# Altium schematic sheet CAN + LIN.SchDoc: MISKO 3.0
size A4; Date: 19.9.2021; Author: AMADEJ PAPEŽ; SheetNumber: 8; SheetTotal: 13; Version: V1.1; SheetTitle: CAN + LIN
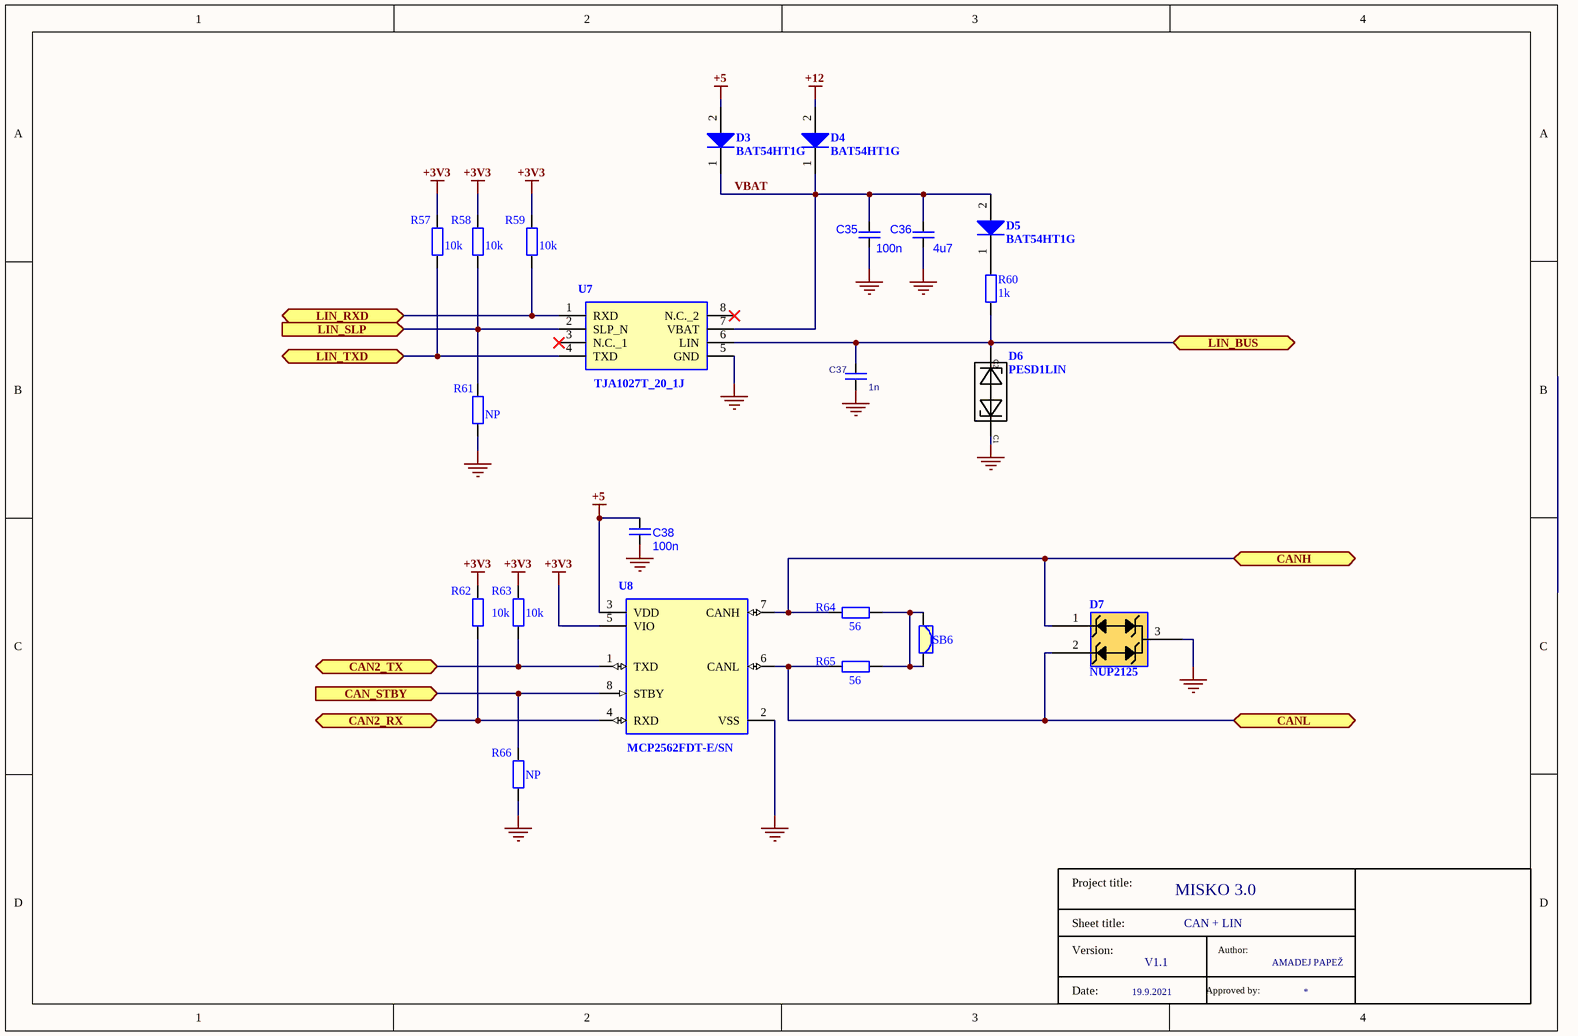
[diagram p0: CAN + LIN.SchDoc]

## Parts
C35  value 100n  [C0603]
C36  value 4u7  [C0603]
C37  value 1n  [C0603]
C38  value 100n  [C0603]
D3  BAT54HT1G  [ONSC-SOD-323-2-477-02_V]
D4  BAT54HT1G  [ONSC-SOD-323-2-477-02_V]
D5  BAT54HT1G  [ONSC-SOD-323-2-477-02_V]
D6  PESD1LIN  [PESD1LIN_footprint]
D7  NUP2125  [SOT23127P600-8N]
R57  value 10k  [R1608_0603I_L]
R58  value 10k  [R1608_0603I_L]
R59  value 10k  [R1608_0603I_L]
R60  value 1k  [R1608_0603I_L]
R61  value NP  [R1608_0603I_L]
R62  value 10k  [R1608_0603I_L]
R63  value 10k  [R1608_0603I_L]
R64  value 56  [R1608_0603I_L]
R65  value 56  [R1608_0603I_L]
R66  value NP  [R1608_0603I_L]
SB6  SD_JUMP  [SOLDER_JUMPER]  (value not drawn)
T8  (no value)
U7  TJA1027T_20_1J  [SOIC127P600X175-8N]
U8  MCP2562FDT-E/SN  [FP-C04-057-SN-MFG]

## Ports
CAN2_RX (bidir), CAN2_TX (bidir), CAN_STBY (in), CANH (bidir), CANL (bidir), LIN_BUS (bidir), LIN_RXD (bidir), LIN_SLP (in), LIN_TXD (bidir)

## Nets
+3V3: R57.1 R58.1 R59.1 R62.1 R63.1 U8.5(VIO)
+5: C38.2 D3.2(A) U8.3(VDD)
+12: D4.2(A)
GND: C35.1 C36.1 C37.2 C38.1 D6.1(C1) D7.3(GND) R61.1 R66.2 U7.5(GND) U8.2(VSS)
CAN2_RX: R62.2 U8.4(RXD) ; port CAN2_RX
CAN2_TX: R63.2 U8.1(TXD) ; port CAN2_TX
CAN_STBY: R66.1 U8.8(STBY) ; port CAN_STBY
CANH: D7.1(CANL) R64.1 U8.7(CANH) ; port CANH
CANL: D7.2(CANH) R65.1 U8.6(CANL) ; port CANL
LIN_BUS: C37.1 D6.2(C2) R60.2 U7.6(LIN) ; port LIN_BUS
LIN_RXD: R59.2 U7.1(RXD) ; port LIN_RXD
LIN_SLP: R58.2 R61.2 U7.2(SLP_N) ; port LIN_SLP
LIN_TXD: R57.2 U7.4(TXD) ; port LIN_TXD
VBAT: C35.2 C36.2 D3.1(K) D4.1(K) D5.2(A) U7.7(VBAT)
NetD5_1: D5.1(K) R60.1
NetR64_2: R64.2 R65.2 SB6.1 SB6.2

Not connected (* = marked no-connect by the designer): U7 3(N.C._1)* 8(N.C._2)*

## Notes on the sheet
- (in symbol Title block) Project title:; Sheet title:; Version:; Author:; Date:; Approved by:

## Library data of the parts
C35 C38 = C: Capacitor; Code: NB6-100N
C36 = C: Capacitor; Code: NB7-4U7-25V
C37 = C: Capacitor; Code: NB4-1N
D3-D5 = BAT54HT1G: Schottky Barrier Diode, 2-Pin SOD-323, Pb-Free, Tape and Reel; Manufacturer: ON Semiconductor / Fairchild; Configuration: Single; trr Max (ns): 5; IFSM Max (A): 0.6; Code: KDBAT54H; ComponentLink3URL: http://www.onsemi.com/pub_link/Collateral/477-02.PDF.1; PackageDescription: 2-Pin SOD, Body 1.7 x 1.25 mm; ComponentLink2URL: http://www.onsemi.cn/pub_link/Collateral/BAT54HT1-D.PDF; ComponentLink3Description: Package Specification; ComponentLink2Description: Datasheet; DatasheetVersion: Rev. 6; PackageReference: SOD-323-2-477-02; RoHS: TRUE; ComponentLink1URL: http://www.onsemi.com/; Packing: Tape and Reel; PartNumber: BAT54HT1G; Mounting Technology: Surface Mount; ComponentLink1Description: Manufacturer URL; PackageVersion: Rev. H, 03/2007; Manufacturer Part Number: BAT54HT1G
D6 = PESD1LIN: LIN-bus ESD protection diode; Code: KD-PESD1LIN
D7 = NUP2125: SOT23127P600-8N / Dual Line Automotive Bus protection / Datasheet: https://www.onsemi.com/pdf/datasheet/nup2125-d.pdf; Code: KD-NUP2125
R57-R59 R62 R63 = R: Code: LC5-10K
R60 = R: Code: LC4-1K
R61 R66 = R
R64 R65 = R: Code: LC2-56E
T8 = Title block
U7 = TJA1027T_20_1J: Integrated Circuit, LIN Transciever / DataSheet: / https://www.nxp.com/docs/en/data-sheet/TJA1027.pdf; Manufacturer_Name: NXP; Manufacturer_Part_Number: TJA1027T/20/1J; Code: FC-TJA1027; Datasheet Link: http://www.nxp.com/docs/en/data-sheet/TJA1027.pdf; Height: 1.75mm; Mouser Part Number: 771-TJA1027T/20/1J; Mouser Price/Stock: https://www.mouser.co.uk/ProductDetail/NXP-Semiconductors/TJA1027T-20-1J?qs=8qdoF%2F2f1vr94fCG5MNBhg%3D%3D; Arrow Part Number: TJA1027T/20/1J; Arrow Price/Stock: https://www.arrow.com/en/products/tja1027t201j/nxp-semiconductors
U8 = MCP2562FDT-E/SN: IC TRANSCEIVER 1/1 8SOIC; Operating Supply Current: 70mA; Data Rate: 8Mbps; Number of Transceivers: 1; Receiver Hysteresis: 200mV; Max Supply Voltage: 5.5V; Min Supply Voltage: 4.5V; Code: FC-MCP2562FD; Weight: 0.019048oz; Package Quantity: 3300; Case/Package: SOIC; Mount: Surface Mount; Max Operating Temperature: 125°C; Min Operating Temperature: -40°C; Packaging: Tape and Reel; Number of Pins: 8